# Altium schematic sheet nRF52832.SchDoc
size A
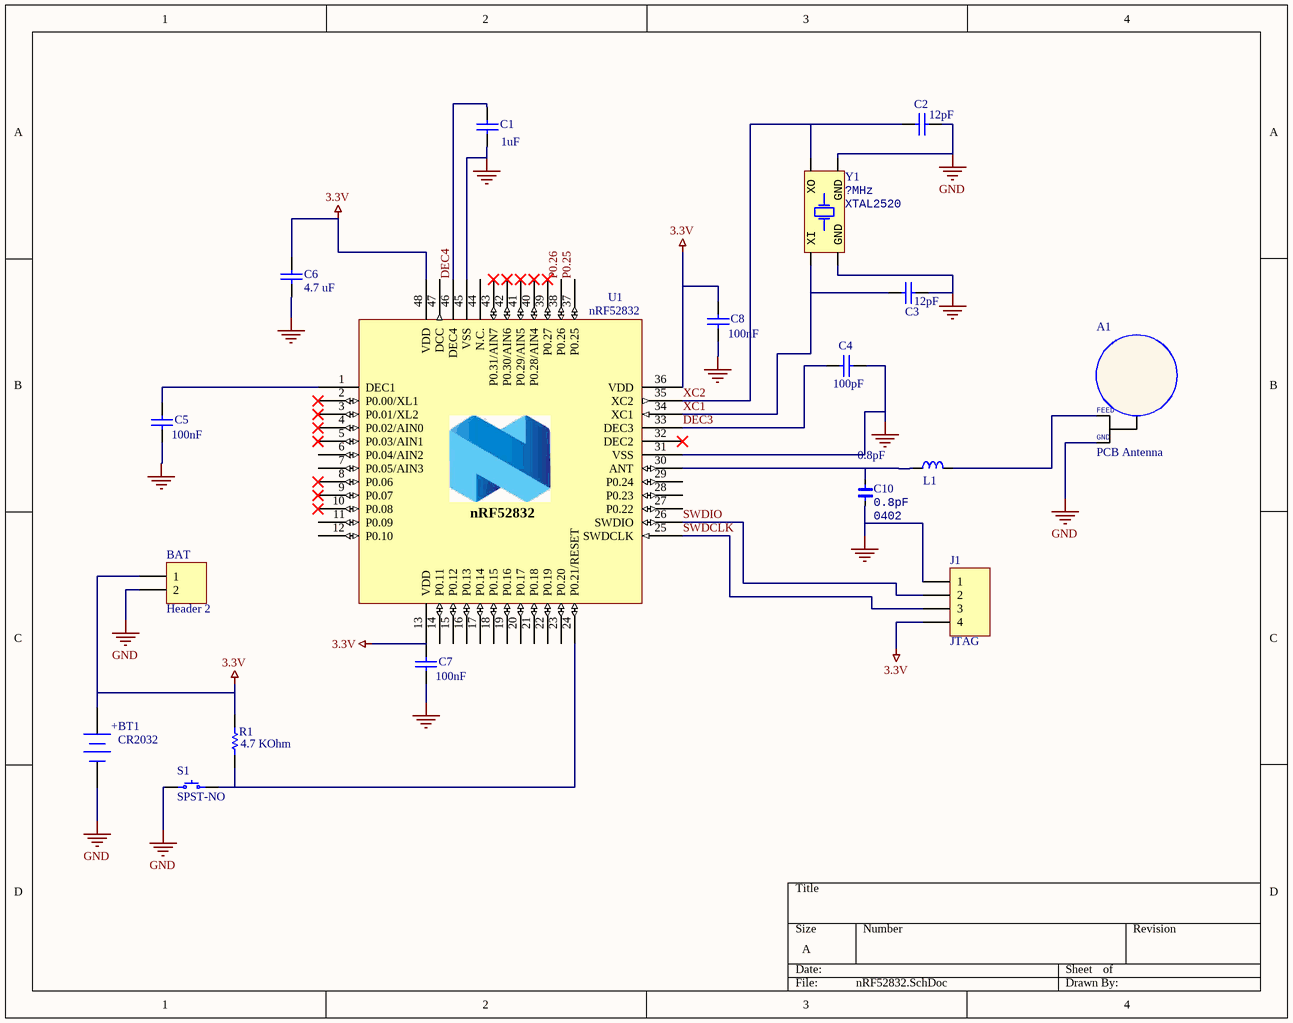
[diagram p0: nRF52832.SchDoc]

## Parts
A1  PCB Antenna  [BLE_MIFA]
BAT  Header 2  [HDR1X2]
BT1  CR2032  [CR2032-1]
C1  value 1uF  [CAPC1608X90X35LL10T15]  (hidden comment: GRM188R61E105KA12D)
C2  value 12pF  [CAPC1005X55X25ML05T10]  (hidden comment: GRM1555C1H120GA01D)
C3  value 12pF  [CAPC1005X55X25ML05T10]  (hidden comment: GRM1555C1H120GA01D)
C4  value 100pF  [CAPC1005X55X25ML05T10]  (hidden comment: GRM1555C1H101JA01D)
C5  value 100nF  [CAPC1005X55X30LL05T10]  (hidden comment: C0402C104K4RACTU)
C6  value 4.7 uF  [CAPC1608X90X35NL10T15]  (hidden comment: GRM188R60J475KE19D)
C7  value 100nF  [CAPC1005X55X30LL05T10]  (hidden comment: C0402C104K4RACTU)
C8  value 100nF  [CAPC1005X55X30LL05T10]  (hidden comment: C0402C104K4RACTU)
C10  value 0.8pF  Type: 0402  [0402_1x0.5x0.5mm]  (hidden comment: C0402)
J1  JTAG  [HDR1X4]
L1  SMD_Inductor  [FER 0402/1005]  (value not drawn)
R1  value 4.7 KOhm  [RESC1005X40X25LL05T05]  (hidden comment: CRCW04024K70FKED)
S1  SPST-NO  [C&K KXT]
U1  nRF52832  [nRF52832_QFAA]
Y1  value ?MHz  [XT_2520_4]  (hidden comment: XTAL2520)

## Nets
3.3V: BAT.1 BT1.1(+) C6.2 C7.2 C8.2 J1.4 R1.2 U1.13(VDD) U1.36(VDD) U1.48(VDD)
GND: A1.0(GND) BAT.2 BT1.2(-) C1.1 C2.2 C3.2 C4.2 C5.1 C6.1 C7.1 C8.1 C10.1 J1.1 S1.1 U1.31(VSS) U1.45(VSS) Y1.2(GND) Y1.4(GND)
DEC3: C4.1 U1.33(DEC3)
DEC4: C1.2 U1.46(DEC4)
P0.25: U1.37(P0.25)
P0.26: U1.38(P0.26)
SWDCLK: J1.3 U1.25(SWDCLK)
SWDIO: J1.2 U1.26(SWDIO)
XC1: C3.1 U1.34(XC1) Y1.1(XI)
XC2: C2.1 U1.35(XC2) Y1.3(XO)
NetA1_1: A1.1(Feed) L1.2
NetC5_2: C5.2 U1.1(DEC1)
NetC10_2: C10.2 L1.1 U1.30(ANT)
NetR1_1: R1.1 S1.2 U1.24(P0.21/RESET)

Not connected (* = marked no-connect by the designer): U1 2(P0.00/XL1)* 3(P0.01/XL2)* 4(P0.02/AIN0)* 5(P0.03/AIN1)* 6(P0.04/AIN2) 7(P0.05/AIN3) 8(P0.06)* 9(P0.07)* 10(P0.08)* 11(P0.09) 12(P0.10) 14(P0.11) 15(P0.12) 16(P0.13) 17(P0.14) 18(P0.15) 19(P0.16) 20(P0.17) 21(P0.18) 22(P0.19) 23(P0.20) 27(P0.22) 28(P0.23) 29(P0.24) 32(DEC2)* 39(P0.27)* 40(P0.28/AIN4)* 41(P0.29/AIN5)* 42(P0.30/AIN6)* 43(P0.31/AIN7)* 44(N.C.) 47(DCC)

## Notes on the sheet
- (in symbol BLE_MIFA) FEED

## Library data of the parts
A1 = BLE_MIFA: Value: DNF
BAT = Header 2: Header, 2-Pin; Value: DNF; LatestRevisionDate: 17-Jul-2002; LatestRevisionNote: Re-released for DXP Platform.
BT1 = CR2032 Cell Holder: Revised: Zion Blue; Published: 06-May-2014; LatestRevisionDate: 17-Jul-2002; LatestRevisionNote: Re-released for DXP Platform.; Publisher: Cynetik Group
C1 = CMP-2006-02459-1: Manufacturer: Murata; Material: Ceramic; Tolerance: 10%; Voltage Rating: 25V; Dielectric: X5R; Part Number: GRM188R61E105KA12D; Supplier 1: RSComponents; Supplier Part Number 1: 723-5587P; Manufacturer Part Number: GRM188R61E105KA12D; RoHS: Yes; Stock 1: 97; Pricing 1: 200 = 0.17000 (HKD); Mount: Surface Mount; Case/Package: 0603; Number of Pins: 2; Case Code (Metric): 1608; Case Code (Imperial): 0603; Min Operating Temperature: -55°C; Max Operating Temperature: 85°C; Packaging: Tape and Reel; Voltage Rating (DC): 25V; Termination: SMD/SMT; Package Quantity: 4000; Voltage: 25V; Length: 1.6mm; Height: 0.8mm; Width: 0.031inch; Thickness: 0.035inch; Depth: 0.8mm; Radiation Hardening: No; REACH SVHC: No SVHC; Lead Free: Lead Free; ComponentLink1URL: http://uk.rs-online.com/webdocs/1423/0900766b81423d08.pdf?src-supplier=RSComponents; ComponentLink1Description: http://uk.rs-online.com/webdocs/1423/0900766b81423d08.pdf?src-supplier=RSComponents; ComponentLink2URL: https://www.murata.com/~/media/webrenewal/support/library/catalog/products/capacitor/mlcc/c02e.ashx?la=en-us&src-supplier=Digi-Key; ComponentLink2Description: https://www.murata.com/~/media/webrenewal/support/library/catalog/products/capacitor/mlcc/c02e.ashx?la=en-us&src-supplier=Digi-Key; ComponentLink3URL: http://www.farnell.com/datasheets/1784406.pdf?src-supplier=Element14; ComponentLink3Description: http://www.farnell.com/datasheets/1784406.pdf?src-supplier=Element14; ComponentLink4URL: http://www.jameco.com/Jameco/Products/ProdDS/1857399.pdf?src-supplier=Jameco; ComponentLink4Description: http://www.jameco.com/Jameco/Products/ProdDS/1857399.pdf?src-supplier=Jameco; ComponentLink5URL: http://www.farnell.com/datasheets/2047765.pdf?src-supplier=Element14; ComponentLink5Description: http://www.farnell.com/datasheets/2047765.pdf?src-supplier=Element14; ComponentLink6URL: http://psearch.murata.com/capacitor/product/GRM188R61C474KA93%23.pdf?src-supplier=Future+Electronics; ComponentLink6Description: http://psearch.murata.com/capacitor/product/GRM188R61C474KA93%23.pdf?src-supplier=Future+Electronics; ComponentLink7URL: https://www.distrelec.biz/Web/Downloads/_t/ds/murata_MLCC_eng_tds.pdf?mime=application%2Fpdf&src-supplier=Distrelec; ComponentLink7Description: https://www.distrelec.biz/Web/Downloads/_t/ds/murata_MLCC_eng_tds.pdf?mime=application%2Fpdf&src-supplier=Distrelec; ComponentLink8URL: http://www.farnell.com/datasheets/608985.pdf?src-supplier=Element14; ComponentLink8Description: http://www.farnell.com/datasheets/608985.pdf?src-supplier=Element14; ComponentLink9URL: http://components.arrow.com/part/dataview/41894231S6753147N2606?src-supplier=Arrow; ComponentLink9Description: http://components.arrow.com/part/dataview/41894231S6753147N2606?src-supplier=Arrow; ComponentLink10URL: http://www.produktinfo.conrad.com/datenblaetter/450000-474999/450696-da-01-de-VS_CHIP_KOND_0603_1_0_UF_10Pr_25_0V_X5R.pdf?src-supplier=Conrad; ComponentLink10Description: http://www.produktinfo.conrad.com/datenblaetter/450000-474999/450696-da-01-de-VS_CHIP_KOND_0603_1_0_UF_10Pr_25_0V_X5R.pdf?src-supplier=Conrad; ComponentLink11URL: http://www.produktinfo.conrad.com/datenblaetter/450000-474999/454470-da-01-en-VS_KONDENSATOR_0603.pdf?src-supplier=Conrad; ComponentLink11Description: http://www.produktinfo.conrad.com/datenblaetter/450000-474999/454470-da-01-en-VS_KONDENSATOR_0603.pdf?src-supplier=Conrad
C2 C3 = CMP-2008-03945-1: Manufacturer: Murata; Material: Ceramic; Voltage Rating: 50V; Dielectric: C0G; Tolerance: 2%; Part Number: GRM1555C1H120GA01D; Supplier 1: Digi-Key; Supplier Part Number 1: 490-6197-1-ND; Manufacturer Part Number: GRM1555C1H120GA01D; RoHS: Yes; Stock 1: 989398; Pricing 1: 1 = 0.10000, 10 = 0.05600, 100 = 0.02480, 500 = 0.01772, 1000 = 0.01392, 2500 = 0.01265, 5000 = 0.01164 (USD); Mount: Surface Mount; Case/Package: 0402; Case Code (Metric): 1005; Case Code (Imperial): 0402; Min Operating Temperature: -55°C; Max Operating Temperature: 125°C; Packaging: Tape and Reel; Voltage Rating (DC): 50V; Package Quantity: 10000; Termination: SMD/SMT; Voltage: 50V; Length: 1mm; Height: 0.5mm; Width: 0.5mm; Depth: 0.5mm; Thickness: 0.022inch; Radiation Hardening: No; Lead Free: Lead Free; REACH SVHC: No SVHC; ComponentLink1URL: https://www.murata.com/~/media/webrenewal/support/library/catalog/products/capacitor/mlcc/c02e.ashx?src-supplier=Mouser; ComponentLink1Description: https://www.murata.com/~/media/webrenewal/support/library/catalog/products/capacitor/mlcc/c02e.ashx?src-supplier=Mouser; ComponentLink2URL: https://www.murata.com/~/media/webrenewal/support/library/catalog/products/capacitor/mlcc/c02e.ashx?la=en-us&src-supplier=Digi-Key; ComponentLink2Description: https://www.murata.com/~/media/webrenewal/support/library/catalog/products/capacitor/mlcc/c02e.ashx?la=en-us&src-supplier=Digi-Key; ComponentLink3URL: http://psearch.murata.com/capacitor/product/GRM1555C1H120GA01%23.pdf?src-supplier=Future+Electronics; ComponentLink3Description: http://psearch.murata.com/capacitor/product/GRM1555C1H120GA01%23.pdf?src-supplier=Future+Electronics; ComponentLink4URL: https://www.murata.com/~/media/webrenewal/support/library/catalog/products/capacitor/mlcc/c02e.ashx?src-supplier=Avnet+Europe; ComponentLink4Description: https://www.murata.com/~/media/webrenewal/support/library/catalog/products/capacitor/mlcc/c02e.ashx?src-supplier=Avnet+Europe; ComponentLink5URL: https://www.murata.com/~/media/webrenewal/support/library/catalog/products/capacitor/mlcc/c02e.ashx?src-supplier=Verical; ComponentLink5Description: https://www.murata.com/~/media/webrenewal/support/library/catalog/products/capacitor/mlcc/c02e.ashx?src-supplier=Verical; ComponentLink6URL: https://www.murata.com/~/media/webrenewal/support/library/catalog/products/capacitor/mlcc/c02e.ashx?src-supplier=Avnet; ComponentLink6Description: https://www.murata.com/~/media/webrenewal/support/library/catalog/products/capacitor/mlcc/c02e.ashx?src-supplier=Avnet
C4 = CMP-2008-03915-1: Manufacturer: Murata; Material: Ceramic; Tolerance: 5%; Voltage Rating: 50V; Dielectric: C0G; Part Number: GRM1555C1H101JA01D; Supplier 1: Digi-Key; Supplier Part Number 1: 490-5922-1-ND; Manufacturer Part Number: GRM1555C1H101JA01D; RoHS: Yes; Stock 1: 9403980; Pricing 1: 1 = 0.10000, 10 = 0.03500, 100 = 0.01580, 500 = 0.01128, 1000 = 0.00886, 2500 = 0.00805, 5000 = 0.00741 (USD); Mount: Surface Mount; Case/Package: 0402; Case Code (Metric): 1005; Case Code (Imperial): 0402; Min Operating Temperature: -55°C; Max Operating Temperature: 125°C; Packaging: Tape and Reel; Package Quantity: 1; Voltage Rating (DC): 50V; Termination: SMD/SMT; Voltage: 50V; Length: 1mm; Height: 0.5mm; Width: 0.02inch; Thickness: 0.022inch; Depth: 0.5mm; Radiation Hardening: No; Lead Free: Lead Free; REACH SVHC: No SVHC; ComponentLink1URL: http://uk.rs-online.com/webdocs/1423/0900766b81423dc4.pdf?src-supplier=RSComponents; ComponentLink1Description: http://uk.rs-online.com/webdocs/1423/0900766b81423dc4.pdf?src-supplier=RSComponents; ComponentLink2URL: http://psearch.murata.com/capacitor/product/GRM1555C1H101JA01%23.pdf?src-supplier=Future+Electronics; ComponentLink2Description: http://psearch.murata.com/capacitor/product/GRM1555C1H101JA01%23.pdf?src-supplier=Future+Electronics; ComponentLink3URL: https://www.murata.com/~/media/webrenewal/support/library/catalog/products/capacitor/mlcc/c02e.ashx?la=en-us&src-supplier=Digi-Key; ComponentLink3Description: https://www.murata.com/~/media/webrenewal/support/library/catalog/products/capacitor/mlcc/c02e.ashx?la=en-us&src-supplier=Digi-Key; ComponentLink4URL: https://www.verical.com/server-webapp/html/getDatasheet?partID=199957&src-supplier=Verical; ComponentLink4Description: https://www.verical.com/server-webapp/html/getDatasheet?partID=199957&src-supplier=Verical; ComponentLink5URL: https://produktinfo.conrad.com/datenblaetter/450000-474999/453557-da-01-en-VS_KONDENSATOR_0402.pdf?src-supplier=Conrad; ComponentLink5Description: https://produktinfo.conrad.com/datenblaetter/450000-474999/453557-da-01-en-VS_KONDENSATOR_0402.pdf?src-supplier=Conrad
C5 C7 C8 = CMP-2008-03084-1: Manufacturer: Kemet; Manufacturer Part Number: C0402C104K4RAC-TU; Dielectric Material: Ceramic; Tolerance: 10%; Voltage Rating (DC): 16V; Dielectric: X7R; Dissipation Factor: 3.5%; Part Number: C0402C104K4RACTU; Supplier 1: Allied Electronics; Supplier Part Number 1: 70095394; RoHS: Yes; Mount: PCB,Surface Mount; Case/Package: 0402; Number of Pins: 2; Case Code (Metric): 1005; Case Code (Imperial): 0402; Contact Plating: Matte,Tin; Min Operating Temperature: -55°C; Max Operating Temperature: 125°C; Packaging: Tape and Reel; Termination: SMD/SMT; Voltage Rating: 16V; Package Quantity: 1; Voltage: 16V; Length: 1mm; Height: 0.5mm; Width: 0.02inch; Depth: 0.5mm; Thickness: 0.022inch; Lead Pitch: 0.3mm; Radiation Hardening: No; REACH SVHC: No SVHC; ComponentLink1URL: http://www.farnell.com/datasheets/1851736.pdf?src-supplier=Element14; ComponentLink1Description: http://www.farnell.com/datasheets/1851736.pdf?src-supplier=Element14; ComponentLink2URL: http://www.kemet.com/Lists/ProductCatalog/Attachments/53/KEM_C1002_X7R_SMD.pdf?src-supplier=Mouser; ComponentLink2Description: http://www.kemet.com/Lists/ProductCatalog/Attachments/53/KEM_C1002_X7R_SMD.pdf?src-supplier=Mouser; ComponentLink3URL: http://www.alliedelec.com/m/d/9bfe7773041ffe9d406e68bc7b377fdd.pdf?src-supplier=Allied+Electronics; ComponentLink3Description: http://www.alliedelec.com/m/d/9bfe7773041ffe9d406e68bc7b377fdd.pdf?src-supplier=Allied+Electronics; ComponentLink4URL: https://www.verical.com/server-webapp/html/getDatasheet?partID=37082&src-supplier=Verical; ComponentLink4Description: https://www.verical.com/server-webapp/html/getDatasheet?partID=37082&src-supplier=Verical
C6 = CMP-2006-02799-2: Chip Capacitor, 4.7 uF, +/- 10%, 6.3 V, -55 to 85 degC, 0603 (1608 Metric), RoHS, Tape and Reel; Manufacturer: Murata; Voltage Rating (DC): 3 V; Voltage Rating: 6.3 V; Type (Capacitors): X5R; Material: Ceramic; Voltage: 6.3V; Case/Package: 0603; Case Code (Imperial): 0603; Packaging: Tape and Reel; Mount: Surface Mount; Height: 0.8 mm; REACH SVHC: No SVHC; ComponentLink1URL: http://www.murata.com/; ComponentLink2URL: http://psearch.en.murata.com/capacitor/product/GRM188R60J475KE19%23.pdf; Min Operating Temperature: -55 degC; Max Operating Temperature: 85 degC; Length: 1.6 mm; Case Code (Metric): 1608; Radiation Hardening: No; PackageDescription: 2-Pin Surface Mount Device, Body 1.6 x 0.8 mm; RoHSCompliant: true; PartNumber: GRM188R60J475KE19D; Tolerance: 10%; Width: 0.8 mm; ComponentLink1Description: Manufacturer URL; Mounting Technology: Surface Mount; ComponentLink2Description: Datasheet; Package Quantity: 4000; DatasheetVersion: 08/2016; Supplier 1: Future Electronics; Supplier Part Number 1: GRM188R60J475KE19D-REEL; Manufacturer Part Number: GRM188R60J475KE19D; RoHS: Yes; Stock 1: 636000; Pricing 1: 4000 = 0.03500 (USD); Termination: SMD/SMT; Dielectric: X5R; Depth: 0.8mm; Thickness: 0.035inch; Lead Free: Lead Free; ComponentLink3URL: http://uk.rs-online.com/webdocs/1423/0900766b81423cfd.pdf?src-supplier=RSComponents; ComponentLink3Description: http://uk.rs-online.com/webdocs/1423/0900766b81423cfd.pdf?src-supplier=RSComponents; ComponentLink4URL: http://psearch.murata.com/capacitor/product/GRM188R60J225KE19%23.pdf?src-supplier=Future+Electronics; ComponentLink4Description: http://psearch.murata.com/capacitor/product/GRM188R60J225KE19%23.pdf?src-supplier=Future+Electronics; ComponentLink5URL: https://www.distrelec.biz/Web/Downloads/_t/ds/murata_MLCC_eng_tds.pdf?mime=application%2Fpdf&src-supplier=Distrelec; ComponentLink5Description: https://www.distrelec.biz/Web/Downloads/_t/ds/murata_MLCC_eng_tds.pdf?mime=application%2Fpdf&src-supplier=Distrelec; ComponentLink6URL: http://www.farnell.com/datasheets/1784405.pdf?src-supplier=Element14; ComponentLink6Description: http://www.farnell.com/datasheets/1784405.pdf?src-supplier=Element14; ComponentLink7URL: https://www.murata.com/~/media/webrenewal/support/library/catalog/products/capacitor/mlcc/c02e.ashx?la=en-us&src-supplier=Digi-Key; ComponentLink7Description: https://www.murata.com/~/media/webrenewal/support/library/catalog/products/capacitor/mlcc/c02e.ashx?la=en-us&src-supplier=Digi-Key; ComponentLink8URL: http://components.arrow.com/part/dataview/41894159S8888104N2606?src-supplier=Arrow; ComponentLink8Description: http://components.arrow.com/part/dataview/41894159S8888104N2606?src-supplier=Arrow; ComponentLink9URL: http://www.produktinfo.conrad.com/datenblaetter/450000-474999/454413-da-01-en-VS_KONDENSATOR_0603.pdf?src-supplier=Conrad; ComponentLink9Description: http://www.produktinfo.conrad.com/datenblaetter/450000-474999/454413-da-01-en-VS_KONDENSATOR_0603.pdf?src-supplier=Conrad; ComponentLink10URL: http://www.produktinfo.conrad.com/datenblaetter/450000-474999/450763-da-01-de-VS_CHIP_KOND_0603_4_7_UF_10Pr_6_3V_X5R.pdf?src-supplier=Conrad; ComponentLink10Description: http://www.produktinfo.conrad.com/datenblaetter/450000-474999/450763-da-01-de-VS_CHIP_KOND_0603_4_7_UF_10Pr_6_3V_X5R.pdf?src-supplier=Conrad
C10 = Cap_0402: Capacitor; Manufacturer Part Number: 04023J0R8ABSTR; Specification: X7R 50V; Voltage Rating: 25V; Dielectric: C0G; Temperature Coefficient: 30ppm/°C; Self Resonant Frequency: 9.1GHz; Manufacturer: *; Supplier 1: Digi-Key; Supplier Part Number 1: 478-10666-1-ND; RoHS: Yes; Stock 1: 11952; Pricing 1: 1 = 0.87000, 10 = 0.64200, 100 = 0.44020, 500 = 0.34850, 1000 = 0.29348, 2500 = 0.27514 (USD); Mount: Surface Mount; Case/Package: 0402; Case Code (Imperial): 0402; Case Code (Metric): 1005; Min Operating Temperature: -55°C; Max Operating Temperature: 125°C; Capacitance: 0.8pF; Packaging: Tape and Reel; Package Quantity: 5000; Termination: SMD/SMT; Voltage: 25V; Length: 1mm; Height: 0.4mm; Depth: 0.55mm; Radiation Hardening: No; Lead Free: Lead Free; REACH SVHC: No SVHC; ComponentLink1URL: http://www.avx.com/docs/catalogs/accuf-p.pdf?src-supplier=Avnet+Europe; ComponentLink1Description: http://www.avx.com/docs/catalogs/accuf-p.pdf?src-supplier=Avnet+Europe; ComponentLink2URL: http://www.farnell.com/datasheets/31777.pdf?src-supplier=Element14; ComponentLink2Description: http://www.farnell.com/datasheets/31777.pdf?src-supplier=Element14; ComponentLink3URL: http://uk.rs-online.com/webdocs/0def/0900766b80def1f6.pdf?src-supplier=RSComponents; ComponentLink3Description: http://uk.rs-online.com/webdocs/0def/0900766b80def1f6.pdf?src-supplier=RSComponents; ComponentLink4URL: http://www.avxcorp.com/docs/Catalogs/accuf-p.pdf?src-supplier=Avnet; ComponentLink4Description: http://www.avxcorp.com/docs/Catalogs/accuf-p.pdf?src-supplier=Avnet; ComponentLink5URL: http://www.avx.com/docs/Catalogs/accuf-p.pdf?src-supplier=Future+Electronics; ComponentLink5Description: http://www.avx.com/docs/Catalogs/accuf-p.pdf?src-supplier=Future+Electronics
J1 = JTAG: Value: DNF
L1 = SMD_Inductor: Value: 3.9nH
R1 = CMP-2002-00051-2: Chip Resistor, 4.7 KOhm, +/- 1%, 63 mW, -55 to 155 degC, 0402 (1005 Metric), RoHS, Tape and Reel; Manufacturer: Vishay; Power Rating: 63 mW; Voltage Rating: 50 V; Temperature Coefficient: 100ppm/°C; Max Power Dissipation: 63mW; Voltage Rating (DC): 50V; Length: 1 mm; Mount: Surface Mount; Case Code (Metric): 1005; ComponentLink1Description: Datasheet; Package Quantity: 10000; Case Code (Imperial): 0402; Max Operating Temperature: 155 degC; PartNumber: CRCW04024K70FKED; Case/Package: 0402; REACH SVHC: Unknown; PackageDescription: 2-Pin Surface Mount Device, Body 1 x 0.5 mm; Width: 0.5 mm; Min Operating Temperature: -55 degC; Height: 0.35 mm; Packaging: Tape and Reel; Mounting Technology: Surface Mount; Tolerance: 1%; RoHSCompliant: True; ComponentLink1URL: http://www.vishay.com/docs/20035/dcrcwe3.pdf; Supplier 1: Future Electronics; Supplier Part Number 1: CRCW04024K70FKED-REEL; Manufacturer Part Number: CRCW04024K70FKED; RoHS: Yes; Stock 1: 1220000; Pricing 1: 10000 = 0.00780, 40000 = 0.00700, 100000 = 0.00670 (USD); Weight: 2.3E-05oz; Contact Plating: Tin; Composition: Thick Film; Termination: SMD/SMT; Number of Terminations: 2; Military Standard: Not; Features: Automotive AEC-Q200; Depth: 0.5mm; Radiation Hardening: No; Lead Free: Lead Free; ComponentLink2URL: http://www.vishay.com/docs/20035/dcrcwe3.pdf?src-supplier=Avnet; ComponentLink2Description: http://www.vishay.com/docs/20035/dcrcwe3.pdf?src-supplier=Avnet; ComponentLink3URL: http://www.mouser.com/ds/2/427/dcrcwe3-109170.pdf?src-supplier=Mouser; ComponentLink3Description: http://www.mouser.com/ds/2/427/dcrcwe3-109170.pdf?src-supplier=Mouser; ComponentLink4URL: https://www.alliedelec.com/m/d/0c934d6939ccefa68dbe0b96d821c8cf.pdf?src-supplier=Allied+Electronics; ComponentLink4Description: https://www.alliedelec.com/m/d/0c934d6939ccefa68dbe0b96d821c8cf.pdf?src-supplier=Allied+Electronics; ComponentLink5URL: http://www.vishay.com/docs/20035/dcrcwe3.pdf?src-supplier=Digi-Key; ComponentLink5Description: http://www.vishay.com/docs/20035/dcrcwe3.pdf?src-supplier=Digi-Key; ComponentLink6URL: http://www.vishay.com/docs/20035/dcrcwe3.pdf?src-supplier=Avnet+Europe; ComponentLink6Description: http://www.vishay.com/docs/20035/dcrcwe3.pdf?src-supplier=Avnet+Europe; ComponentLink7URL: http://www.farnell.com/datasheets/2045673.pdf?src-supplier=Element14; ComponentLink7Description: http://www.farnell.com/datasheets/2045673.pdf?src-supplier=Element14; ComponentLink8URL: http://uk.rs-online.com/webdocs/13ec/0900766b813ecbe1.pdf?src-supplier=RSComponents; ComponentLink8Description: http://uk.rs-online.com/webdocs/13ec/0900766b813ecbe1.pdf?src-supplier=RSComponents; ComponentLink9URL: https://www.distrelec.biz/Web/Downloads/a_/en/flD-CRCW-e3_data_en.pdf?mime=application%2Fpdf&src-supplier=Distrelec; ComponentLink9Description: https://www.distrelec.biz/Web/Downloads/a_/en/flD-CRCW-e3_data_en.pdf?mime=application%2Fpdf&src-supplier=Distrelec
S1 = SPST-NO 2 PIN: Manufacturer Part Number: KXT 331 LHS
U1 = nRF52832_QFN: Manufacturer: Nordic Semiconductor; Manufacturer Part Number: NRF52832-QFAA-R7; RAM Size: 64Kb; Supplier 1: Digi-Key; Supplier Part Number 1: 1490-1067-1-ND; Stock 1: 4007; Pricing 1: 1 = 5.73000, 10 = 5.11900, 25 = 4.60680, 100 = 4.19740, 250 = 3.78788, 500 = 3.39886 (USD)
Y1 = XTAL_2520_4P: Crystal Oscillator; Type: XTAL2520